# Altium schematic sheet 5V_SMPS.SchDoc
size A4; SheetNumber: 13; SheetTotal: 13
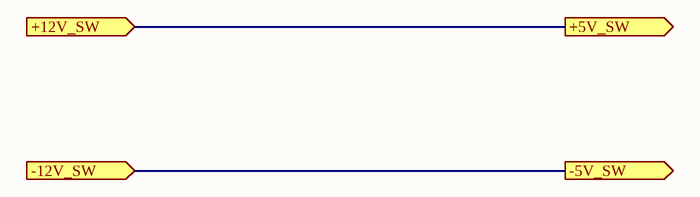
[diagram p0: 5V_SMPS.SchDoc]

## Ports
+5V_SW (out, see Callisto Control Board[3A], 3V3 LDO[2B]), +12V_SW (in, see Callisto Control Board[2A], 12V SMPS[8B], Driver Board[1B]), -5V_SW (out, see Callisto Control Board[3A], 3V3 LDO[2B]), -12V_SW (in, see Callisto Control Board[2A], 12V SMPS[8C])

## Nets
+12V_SW: port +12V_SW, port +5V_SW
-12V_SW: port -12V_SW, port -5V_SW